# Altium schematic sheet TH3.SchDoc
size Letter; SheetNumber: 4; SheetTotal: 6
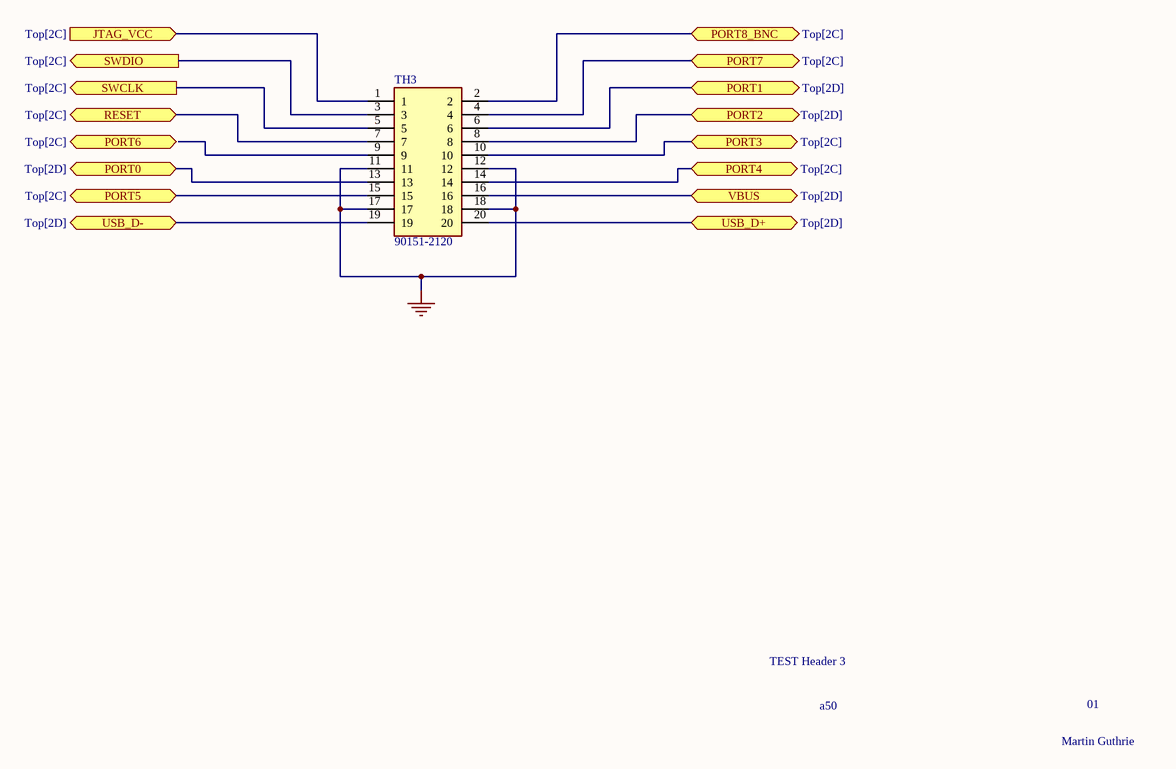
[diagram p0: TH3.SchDoc]

## Parts
TH3  90151-2120  [90151-2120]

## Ports
JTAG_VCC (in, see Top[2C]), PORT0 (bidir, see Top[2D]), PORT1 (bidir, see Top[2D]), PORT2 (bidir, see Top[2D]), PORT3 (bidir, see Top[2C]), PORT4 (bidir, see Top[2C]), PORT5 (bidir, see Top[2C]), PORT6 (bidir, see Top[2C]), PORT7 (bidir, see Top[2C]), PORT8_BNC (bidir, see Top[2C]), RESET (bidir, see Top[2C]), SWCLK (out, see Top[2C]), SWDIO (out, see Top[2C]), USB_D+ (bidir, see Top[2D]), USB_D- (bidir, see Top[2D]), VBUS (bidir, see Top[2D])

## Nets
GND: TH3.11 TH3.12 TH3.17 TH3.18
JTAG_VCC: TH3.1 ; port JTAG_VCC
PORT0: TH3.13 ; port PORT0
PORT1: TH3.6 ; port PORT1
PORT2: TH3.8 ; port PORT2
PORT3: TH3.10 ; port PORT3
PORT4: TH3.14 ; port PORT4
PORT5: TH3.15 ; port PORT5
PORT7: TH3.4 ; port PORT7
PORT8_BNC: TH3.2 ; port PORT8_BNC
RESET: TH3.7 ; port RESET
SWCLK: TH3.5 ; port SWCLK
SWDIO: TH3.3 ; port SWDIO
USB_D+: TH3.20 ; port USB_D+
USB_D-: TH3.19 ; port USB_D-
VBUS: TH3.16 ; port VBUS

Not connected (* = marked no-connect by the designer): TH3 9

## Notes on the sheet
- TEST Header 3
- a50
- 01
- Martin Guthrie

## Library data of the parts
TH3 = 90151-2120: Connector; Manufacturer_Name: Molex; Datasheet Link: https://www.molex.com/pdm_docs/sd/901512120_sd.pdf; Height: 8.7mm; Manufacturer_Part_Number: 90151-2120; Mouser Part Number: 538-90151-2120; Mouser Price/Stock: https://www.mouser.co.uk/ProductDetail/Molex/90151-2120?qs=XmV31zLAuMHqFInYdcmaXg%3D%3D